# EAGLE schematic IO_Expander (EAGLE 6.4)
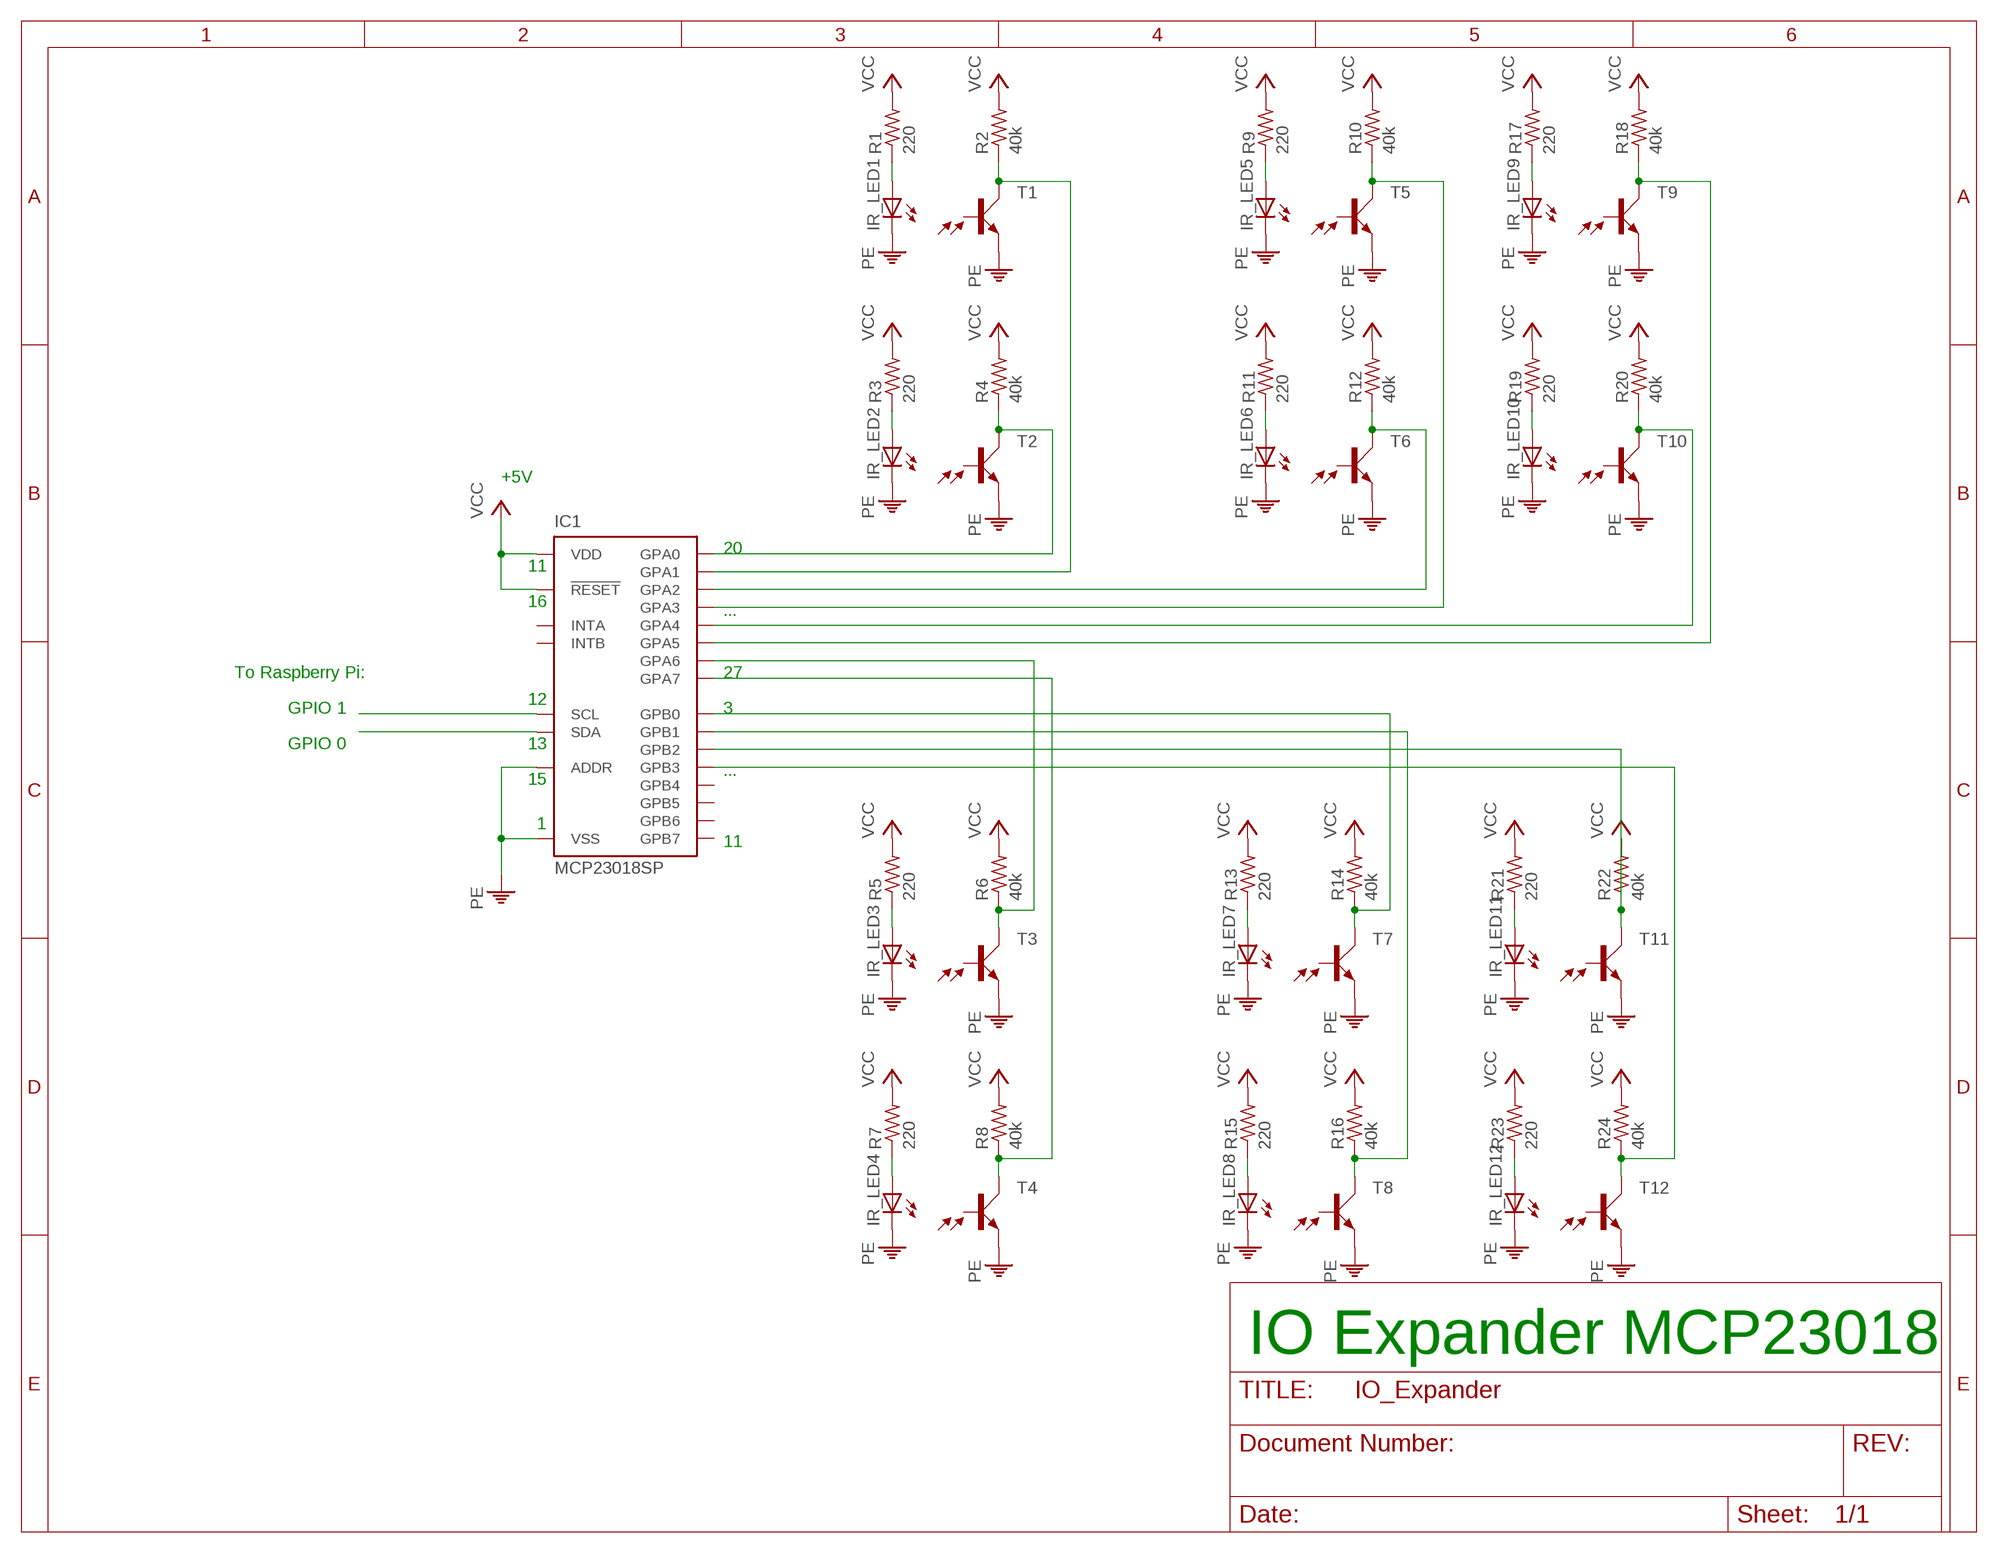
[diagram p0: schematic, sheet 1]

## Parts
IC1  MCP23018SP  [DIL28-3]
IR_LED1  LED5MM  [LED5MM]
IR_LED2  LED5MM  [LED5MM]
IR_LED3  LED5MM  [LED5MM]
IR_LED4  LED5MM  [LED5MM]
IR_LED5  LED5MM  [LED5MM]
IR_LED6  LED5MM  [LED5MM]
IR_LED7  LED5MM  [LED5MM]
IR_LED8  LED5MM  [LED5MM]
IR_LED9  LED5MM  [LED5MM]
IR_LED10  LED5MM  [LED5MM]
IR_LED11  LED5MM  [LED5MM]
IR_LED12  LED5MM  [LED5MM]
R1  220  R-US_0204/7  [0204/7]
R2  40k  R-US_0204/7  [0204/7]
R3  220  R-US_0204/7  [0204/7]
R4  40k  R-US_0204/7  [0204/7]
R5  220  R-US_0204/7  [0204/7]
R6  40k  R-US_0204/7  [0204/7]
R7  220  R-US_0204/7  [0204/7]
R8  40k  R-US_0204/7  [0204/7]
R9  220  R-US_0204/7  [0204/7]
R10  40k  R-US_0204/7  [0204/7]
R11  220  R-US_0204/7  [0204/7]
R12  40k  R-US_0204/7  [0204/7]
R13  220  R-US_0204/7  [0204/7]
R14  40k  R-US_0204/7  [0204/7]
R15  220  R-US_0204/7  [0204/7]
R16  40k  R-US_0204/7  [0204/7]
R17  220  R-US_0204/7  [0204/7]
R18  40k  R-US_0204/7  [0204/7]
R19  220  R-US_0204/7  [0204/7]
R20  40k  R-US_0204/7  [0204/7]
R21  220  R-US_0204/7  [0204/7]
R22  40k  R-US_0204/7  [0204/7]
R23  220  R-US_0204/7  [0204/7]
R24  40k  R-US_0204/7  [0204/7]
T1  SFH303  [SFH303]
T2  SFH303  [SFH303]
T3  SFH303  [SFH303]
T4  SFH303  [SFH303]
T5  SFH303  [SFH303]
T6  SFH303  [SFH303]
T7  SFH303  [SFH303]
T8  SFH303  [SFH303]
T9  SFH303  [SFH303]
T10  SFH303  [SFH303]
T11  SFH303  [SFH303]
T12  SFH303  [SFH303]

## Nets
N$1: IC1.12(SCL)
N$2: IC1.13(SDA)
N$3: IR_LED1.A R1.1
N$4: IC1.21(GPA1) R2.1 T1.2(C)
N$5: IR_LED2.A R3.1
N$6: IC1.20(GPA0) R4.1 T2.2(C)
N$7: IR_LED3.A R5.1
N$8: IC1.26(GPA6) R6.1 T3.2(C)
N$9: IR_LED4.A R7.1
N$10: IC1.27(GPA7) R8.1 T4.2(C)
N$11: IR_LED5.A R9.1
N$12: IC1.23(GPA3) R10.1 T5.2(C)
N$13: IR_LED6.A R11.1
N$14: IC1.22(GPA2) R12.1 T6.2(C)
N$15: IR_LED7.A R13.1
N$16: IC1.3(GPB0) R14.1 T7.2(C)
N$17: IR_LED8.A R15.1
N$18: IC1.4(GPB1) R16.1 T8.2(C)
N$19: IR_LED9.A R17.1
N$20: IC1.25(GPA5) R18.1 T9.2(C)
N$21: IR_LED10.A R19.1
N$22: IC1.24(GPA4) R20.1 T10.2(C)
N$23: IR_LED11.A R21.1
N$24: IC1.5(GPB2) R22.1 T11.2(C)
N$25: IR_LED12.A R23.1
N$26: IC1.6(GPB3) R24.1 T12.2(C)
PE: IC1.1(VSS) IC1.15(ADDR) IR_LED1.K(C) IR_LED2.K(C) IR_LED3.K(C) IR_LED4.K(C) IR_LED5.K(C) IR_LED6.K(C) IR_LED7.K(C) IR_LED8.K(C) IR_LED9.K(C) IR_LED10.K(C) IR_LED11.K(C) IR_LED12.K(C) T1.1(E) T2.1(E) T3.1(E) T4.1(E) T5.1(E) T6.1(E) T7.1(E) T8.1(E) T9.1(E) T10.1(E) T11.1(E) T12.1(E)
VCC: IC1.11(VDD) IC1.16(!RESET) R1.2 R2.2 R3.2 R4.2 R5.2 R6.2 R7.2 R8.2 R9.2 R10.2 R11.2 R12.2 R13.2 R14.2 R15.2 R16.2 R17.2 R18.2 R19.2 R20.2 R21.2 R22.2 R23.2 R24.2
Unconnected: IC1.7(GPB4) IC1.8(GPB5) IC1.9(GPB6) IC1.10(GPB7) IC1.18(INTB) IC1.19(INTA) T1.3(B) T2.3(B) T3.3(B) T4.3(B) T5.3(B) T6.3(B) T7.3(B) T8.3(B) T9.3(B) T10.3(B) T11.3(B) T12.3(B)

## Notes on the sheet
- +5V
- 20
- 11
- 16
- ...
- To Raspberry Pi: | 27
- 12
- GPIO 1 | 3
- GPIO 0 | 13
- ...
- 15
- 1
- 11
- IO Expander MCP23018

## Library data of the parts
IC1 = microchip-exp:MCP23018: http://ww1.microchip.com/downloads/en/DeviceDoc/22103a.pdf Source: http://ww1.microchip.com/downloads/en/DeviceDoc/22103a.pdf Adopted by RobG
IR_LED1-IR_LED12 = led:LED: LED OSRAM: - CHIPLED LG R971, LG N971, LY N971, LG Q971, LY Q971, LO R971, LY R971 LH N974, LH R974 LS Q976, LO Q976, LY Q976 LO Q996 - Hyper CHIPLED LW Q18S LB Q993, LB Q99A, LB R99A - SideLED LS A670, LO A670, LY A670, LG A670, LP A670 LB A673, LV A673, LT A673, LW A673 LH A674 LY A675 LS A676, LA A676, LO A676, LY A676, LW A676 LS A679, LY A679, LG A679 - Hyper Micro SIDELED® LS Y876, LA Y876, LO Y876, LY Y876 LT Y87S - SmartLED LW L88C, LW L88S LB L89C, LB L89S, LG L890 LS L89K, LO L89K, LY L89K LS L896, LA L896, LO L896, LY L896 - TOPLED LS T670, LO T670, LY T670, LG T670, LP T670 LSG T670, LSP T670, LSY T670, LOP T670, LYG T670 LG T671, LOG T671, LSG T671 LB T673, LV T673, LT T673, LW T673 LH T674 LS T676, LA T676, LO T676, LY T676, LB T676, LH T676, LSB T676, LW T676 LB T67C, LV T67C, LT T67C, LS T67K, LO T67K, LY T67K, LW E67C LS E67B, LA E67B, LO E67B, LY E67B, LB E67C, LV E67C, LT E67C LW T67C LS T679, LY T679, LG T679 LS T770, LO T770, LY T770, LG T770, LP T770 LB T773, LV T773, LT T773, LW T773 LH T774 LS E675, LA E675, LY E675, LS T675 LS T776, LA T776, LO T776, LY T776, LB T776 LHGB T686 LT T68C, LB T68C - Hyper Mini TOPLED® LB M676 - Mini TOPLED Santana® LG M470 LS M47K, LO M47K, LY M47K Source: http://www.osram.convergy.de LUXEON: - LUMILED® LXK2-PW12-R00, LXK2-PW12-S00, LXK2-PW14-U00, LXK2-PW14-V00 LXK2-PM12-R00, LXK2-PM12-S00, LXK2-PM14-U00 LXK2-PE12-Q00, LXK2-PE12-R00, LXK2-PE12-S00, LXK2-PE14-T00, LXK2-PE14-U00 LXK2-PB12-K00, LXK2-PB12-L00, LXK2-PB12-M00, LXK2-PB14-N00, LXK2-PB14-P00, LXK2-PB14-Q00 LXK2-PR12-L00, LXK2-PR12-M00, LXK2-PR14-Q00, LXK2-PR14-R00 LXK2-PD12-Q00, LXK2-PD12-R00, LXK2-PD12-S00 LXK2-PH12-R00, LXK2-PH12-S00 LXK2-PL12-P00, LXK2-PL12-Q00, LXK2-PL12-R00 Source: www.luxeon.com KINGBRIGHT: KA-3528ASYC Source: www.kingbright.com
R1-R24 = resistor:R-US_: RESISTOR, American symbol
T1-T12 = opto-trans-siemens:SFH303: Silicium NPN Phototransistor Source: Siemens; OC_FARNELL: unknown; OC_NEWARK: unknown